# Altium project COMS0005_Coms_Test_Board.PrjPCB
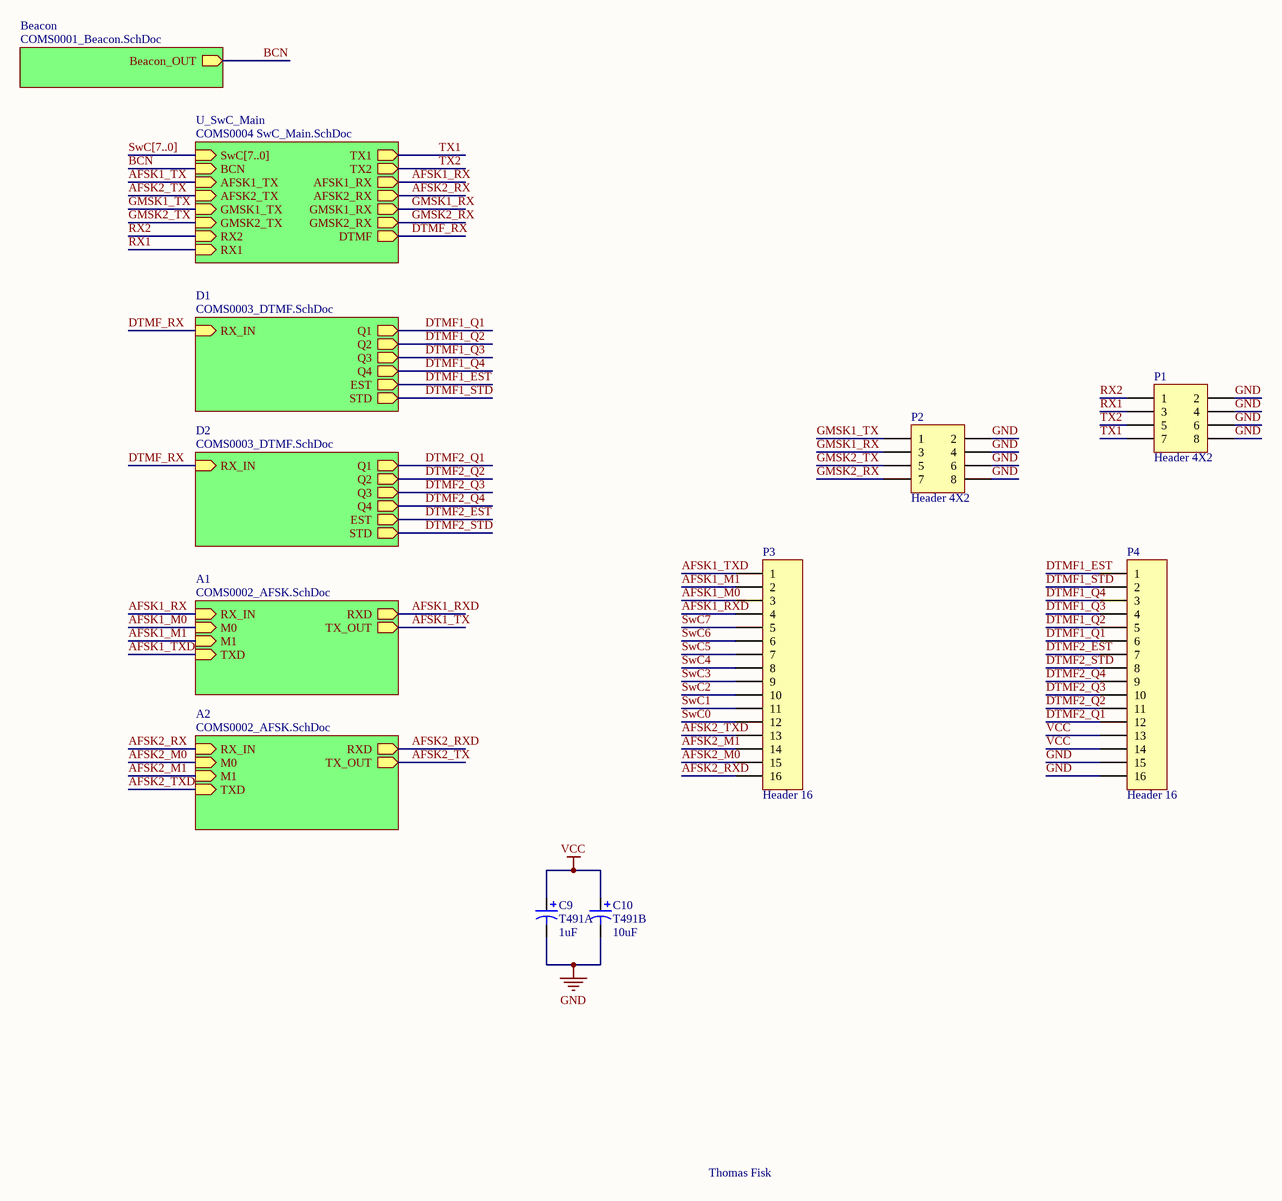
[diagram p0: COMS0010_Comms_Test_Board.SchDoc]
4 sheets, 25 parts. Net scope: hierarchical (ports join the sheet entries above them; power ports are global).
Board file: COMS0009_Coms_Test_Board.PcbDoc
Sheets:
  COMS0010_Comms_Test_Board.SchDoc
    Beacon = COMS0001_Beacon.SchDoc
    U_SwC_Main = COMS0004 SwC_Main.SchDoc
      U_ModemRXMux = COMS0007 ModemRXMux.SchDoc

## Sheet COMS0010_Comms_Test_Board.SchDoc: BLUEsat Communications Test Board
size A3; DrawnBy: Thomas Fisk; Engineer: T. FISK; Organization: BLUEsat Project; Address1: Room 419; Address2: School of EE&T; Address3: UNSW, NSW 2052; Address4: Australia; DocumentNumber: COMS0005; SheetNumber: 1; SheetTotal: 1; Description: Test board for communications subsystem.; Version: 1.0

### Parts
C9  T491A  value 1uF  [A]
C10  T491B  value 10uF  [B]
P1  Header 4X2  [HDR2X4]
P2  Header 4X2  [HDR2X4]
P3  Header 16  [HDR1X16]
P4  Header 16  [HDR1X16]

### Sub-sheets
A1 = COMS0002_AFSK.SchDoc (file not in this document): RX_IN (in), M0 (in), M1 (in), TXD (in), RXD (out), TX_OUT (out)
A2 = COMS0002_AFSK.SchDoc (file not in this document): RX_IN (in), M0 (in), M1 (in), TXD (in), RXD (out), TX_OUT (out)
Beacon = COMS0001_Beacon.SchDoc: Beacon_OUT (out)
D1 = COMS0003_DTMF.SchDoc (file not in this document): RX_IN (in), STD (out), EST (out), Q1 (out), Q2 (out), Q3 (out), Q4 (out)
D2 = COMS0003_DTMF.SchDoc (file not in this document): RX_IN (in), STD (out), EST (out), Q1 (out), Q2 (out), Q3 (out), Q4 (out)
U_SwC_Main = COMS0004 SwC_Main.SchDoc: SwC[7..0] (in), BCN (in), AFSK1_TX (in), AFSK2_TX (in), GMSK1_TX (in), GMSK2_TX (in), TX1 (out), TX2 (out), RX2 (in), RX1 (in), AFSK1_RX (out), AFSK2_RX (out), GMSK1_RX (out), GMSK2_RX (out), DTMF (out)

### Nets
GND: C9.2 C10.2 P1.2 P1.4 P1.6 P1.8 P2.2 P2.4 P2.6 P2.8 P4.15 P4.16
VCC: C9.1 C10.1 P4.13 P4.14
AFSK1_M0: P3.3 ; sheet A1/M0
AFSK1_M1: P3.2 ; sheet A1/M1
AFSK1_RX: sheet A1/RX_IN, sheet U_SwC_Main/AFSK1_RX
AFSK1_RXD: P3.4 ; sheet A1/RXD
AFSK1_TX: sheet A1/TX_OUT, sheet U_SwC_Main/AFSK1_TX
AFSK1_TXD: P3.1 ; sheet A1/TXD
AFSK2_M0: P3.15 ; sheet A2/M0
AFSK2_M1: P3.14 ; sheet A2/M1
AFSK2_RX: sheet A2/RX_IN, sheet U_SwC_Main/AFSK2_RX
AFSK2_RXD: P3.16 ; sheet A2/RXD
AFSK2_TX: sheet A2/TX_OUT, sheet U_SwC_Main/AFSK2_TX
AFSK2_TXD: P3.13 ; sheet A2/TXD
BCN: sheet Beacon/Beacon_OUT, sheet U_SwC_Main/BCN  [project net AF]
DTMF1_EST: P4.1 ; sheet D1/EST
DTMF1_Q1: P4.6 ; sheet D1/Q1
DTMF1_Q2: P4.5 ; sheet D1/Q2
DTMF1_Q3: P4.4 ; sheet D1/Q3
DTMF1_Q4: P4.3 ; sheet D1/Q4
DTMF1_STD: P4.2 ; sheet D1/STD
DTMF2_EST: P4.7 ; sheet D2/EST
DTMF2_Q1: P4.12 ; sheet D2/Q1
DTMF2_Q2: P4.11 ; sheet D2/Q2
DTMF2_Q3: P4.10 ; sheet D2/Q3
DTMF2_Q4: P4.9 ; sheet D2/Q4
DTMF2_STD: P4.8 ; sheet D2/STD
DTMF_RX: sheet D1/RX_IN, sheet D2/RX_IN, sheet U_SwC_Main/DTMF
GMSK1_RX: P2.3 ; sheet U_SwC_Main/GMSK1_RX
GMSK1_TX: P2.1 ; sheet U_SwC_Main/GMSK1_TX
GMSK2_RX: P2.7 ; sheet U_SwC_Main/GMSK2_RX
GMSK2_TX: P2.5 ; sheet U_SwC_Main/GMSK2_TX
RX1: P1.3 ; sheet U_SwC_Main/RX1
RX2: P1.1 ; sheet U_SwC_Main/RX2
SwC0: P3.12
SwC1: P3.11
SwC2: P3.10
SwC3: P3.9
SwC4: P3.8
SwC5: P3.7
SwC6: P3.6
SwC7: P3.5
TX1: P1.7 ; sheet U_SwC_Main/TX1
TX2: P1.5 ; sheet U_SwC_Main/TX2

### Buses and harness runs
bus SwC[7..0] = sheet U_SwC_Main/SwC[7..0]

### Notes on the sheet
- Thomas Fisk
- Title
- Description:
- Size:
- Author:
- Date:
- A3
- Time:
- Version
- Sheet:
- Drawing No.:
- of
- File:

### Library data of the parts
C9 = T491A: Solid Tantalum Chip Capacitor, Standard T491 Series - Industrial Grade; Published: 17-Jul-2002; LatestRevisionDate: 19-Mar-2004; LatestRevisionNote: Silkscreen dimensions re-sized.; DatasheetDocument: Mar-2001; PackageDocument: Mar-2001; PackageReference: A; Publisher: Altium Limited; Code_JEITA: 3216-18; ComponentLink1Description: Manufacturer Link; ComponentLink1URL: http://www.kemet.com/; ComponentLink2Description: Datasheet; ComponentLink2URL: http://www.kemet.com/kemet/web/homepage/kechome.nsf/vapubfilesname/F3102TA.pdf/$file/F3102TA.pdf
C10 = T491B: Solid Tantalum Chip Capacitor, Standard T491 Series - Industrial Grade; Published: 17-Jul-2002; LatestRevisionDate: 19-Mar-2004; LatestRevisionNote: Silkscreen dimensions re-sized.; DatasheetDocument: Mar-2001; PackageDocument: Mar-2001; PackageReference: B; Publisher: Altium Limited; Code_JEITA: 3528-21; ComponentLink1Description: Manufacturer Link; ComponentLink1URL: http://www.kemet.com/; ComponentLink2Description: Datasheet; ComponentLink2URL: http://www.kemet.com/kemet/web/homepage/kechome.nsf/vapubfilesname/F3102TA.pdf/$file/F3102TA.pdf
P1 P2 = Header 4X2: Header, 4-Pin, Dual row; LatestRevisionDate: 17-Jul-2002; LatestRevisionNote: Re-released for DXP Platform.; Publisher: Altium Limited
P3 P4 = Header 16: Header, 16-Pin; LatestRevisionDate: 17-Jul-2002; LatestRevisionNote: Re-released for DXP Platform.; Publisher: Altium Limited

## Sheet COMS0001_Beacon.SchDoc: BLUEsat Beacon
size A3; Author: Daniel Jedrychowski; Engineer: D. JEDRYCHOWSKI; Organization: BLUEsat Project; Address1: Room 419; Address2: School of EE&T; Address3: UNSW, NSW 2052; Address4: Australia; DocumentNumber: COMS0001; SheetNumber: 1; SheetTotal: 1; Description: Morse code continuous wave beacon based on EPROM; Version: 1.1
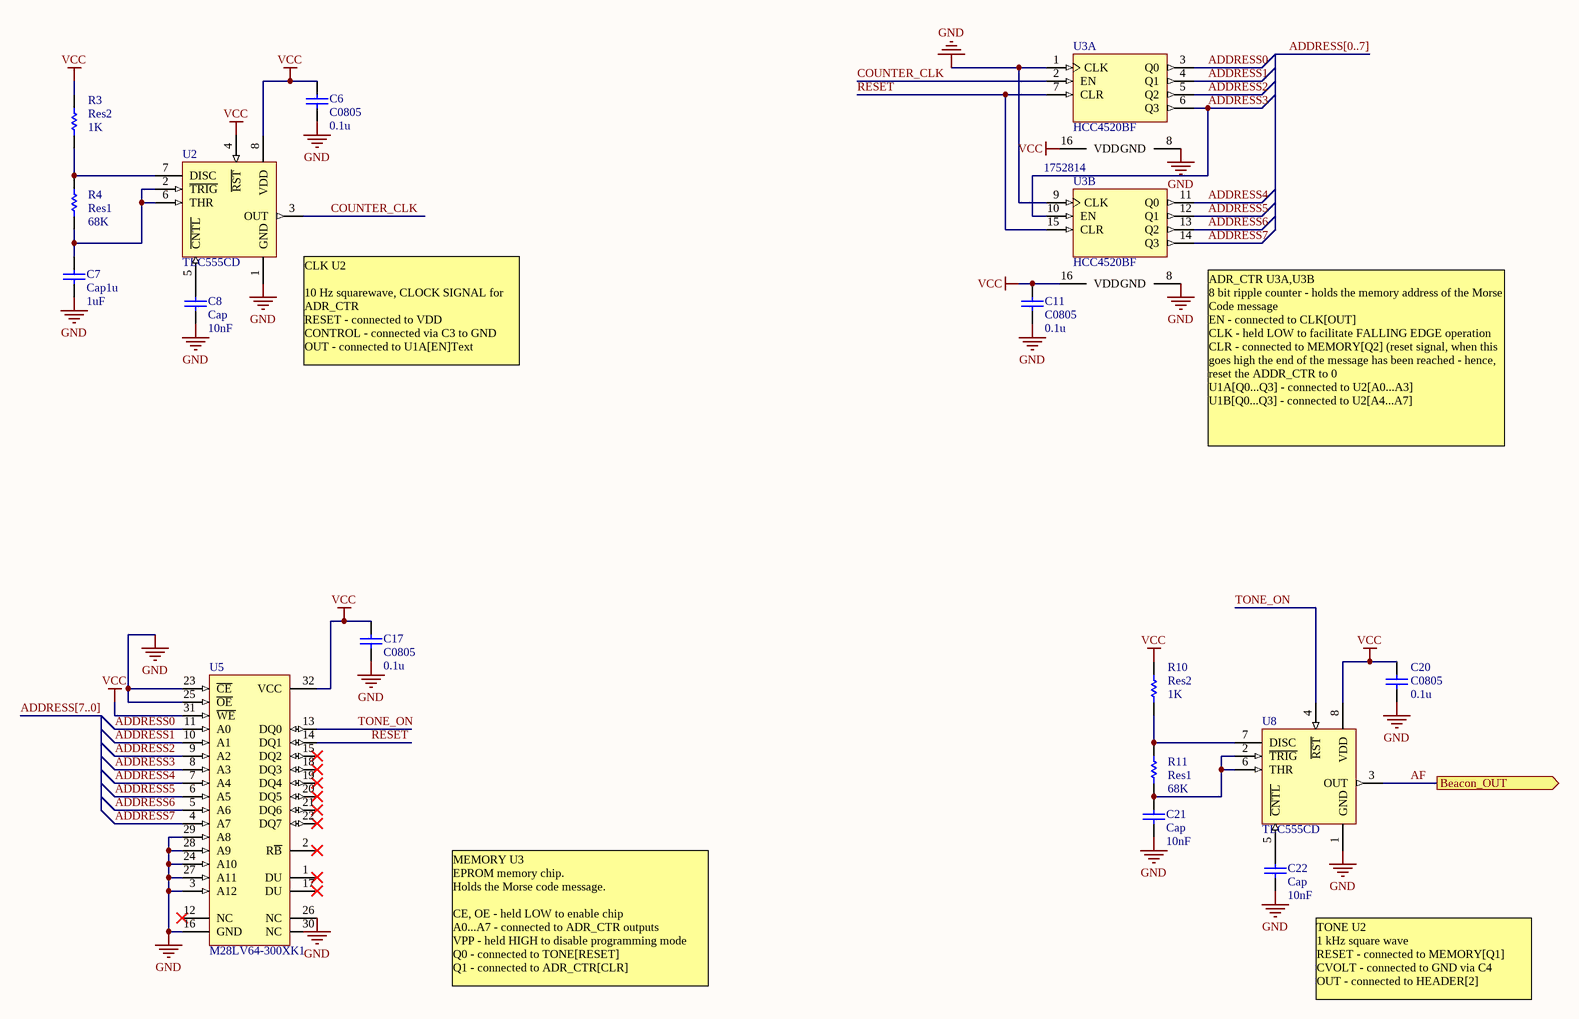
[diagram p1: COMS0001_Beacon.SchDoc]

### Parts
C6  C0805  value 0.1u  [CAPC2012M]
C7  Cap1u  value 1uF  [CAPC2012M]
C8  Cap  value 10nF  [CAPC2012M]
C11  C0805  value 0.1u  [CAPC2012M]
C17  C0805  value 0.1u  [CAPC2012M]
C20  C0805  value 0.1u  [CAPC2012M]
C21  Cap  value 10nF  [CAPC2012M]
C22  Cap  value 10nF  [CAPC2012M]
R3  Res2  value 1K  [RESC2012M]
R4  Res1  value 68K  [RESC2012M]
R10  Res2  value 1K  [RESC2012M]
R11  Res1  value 68K  [RESC2012M]
U2  TLC555CD  [D008_M]
U3  HCC4520BF  [SOIC16_M]  (parts A,B of 2)
U5  M28LV64-300XK1  [PLCC32]
U8  TLC555CD  [D008_M]

### Ports
Beacon_OUT (out)

### Nets
GND: C6.1 C7.1 C8.1 C11.1 C17.1 C20.1 C21.1 C22.1 U2.1(GND) U3.1(CLK) U3.8(GND) U3.9(CLK) U5.3(A12) U5.16(GND) U5.23(~{CE}) U5.24(A10) U5.25(~{OE}) U5.26(NC) U5.27(A11) U5.28(A9) U5.29(A8) U8.1(GND)
VCC: C6.2 C11.2 C17.2 C20.2 R3.2 R10.2 U2.4(~{RST}) U2.8(VDD) U3.16(VDD) U5.31(~{WE}) U5.32(VCC) U8.8(VDD)
ADDRESS0: U3.3(Q0) U5.11(A0)
ADDRESS1: U3.4(Q1) U5.10(A1)
ADDRESS2: U3.5(Q2) U5.9(A2)
ADDRESS3: U3.6(Q3) U3.10(EN) U5.8(A3)
ADDRESS4: U3.11(Q0) U5.7(A4)
ADDRESS5: U3.12(Q1) U5.6(A5)
ADDRESS6: U3.13(Q2) U5.5(A6)
ADDRESS7: U3.14(Q3) U5.4(A7)
AF: U8.3(OUT) ; port Beacon_OUT
COUNTER_CLK: U2.3(OUT) U3.2(EN)
RESET: U3.7(CLR) U3.15(CLR) U5.14(DQ1)
TONE_ON: U5.13(DQ0) U8.4(~{RST})
NetC7_2: C7.2 R4.1 U2.2(~{TRIG}) U2.6(THR)
NetC8_2: C8.2 U2.5(~{CNTL})
NetC21_2: C21.2 R11.1 U8.2(~{TRIG}) U8.6(THR)
NetC22_2: C22.2 U8.5(~{CNTL})
NetR3_1: R3.1 R4.2 U2.7(DISC)
NetR10_1: R10.1 R11.2 U8.7(DISC)

Not connected (* = marked no-connect by the designer): U5 1(DU)* 2(R~{B})* 12(NC)* 15(DQ2)* 17(DU)* 18(DQ3)* 19(DQ4)* 20(DQ5)* 21(DQ6)* 22(DQ7)* 30(NC)

### Buses and harness runs
bus ADDRESS[0..7]
bus ADDRESS[7..0]

### Notes on the sheet
- (near U2) CLK U2
  10 Hz squarewave, CLOCK SIGNAL for ADR_CTR
  RESET - connected to VDD
  CONTROL - connected via C3 to GND
  OUT - connected to U1A[EN]Text
- (near U3) ADR_CTR U3A,U3B
  8 bit ripple counter - holds the memory address of the Morse Code message
  EN - connected to CLK[OUT]
  CLK - held LOW to facilitate FALLING EDGE operation
  CLR - connected to MEMORY[Q2] (reset signal, when this goes high the end of the message has been reached - hence, reset the ADDR_CTR to 0
  U1A[Q0...Q3] - connected to U2[A0...A3]
  U1B[Q0...Q3] - connected to U2[A4...A7]
- MEMORY U3
  EPROM memory chip.
  Holds the Morse code message.
  CE, OE - held LOW to enable chip
  A0...A7 - connected to ADR_CTR outputs
  VPP - held HIGH to disable programming mode
  Q0 - connected to TONE[RESET]
  Q1 - connected to ADR_CTR[CLR]
- TONE U2
  1 kHz square wave
  RESET - connected to MEMORY[Q1]
  CVOLT - connected to GND via C4
  OUT - connected to HEADER[2]
- Title
- Description:
- Size:
- Author:
- Date:
- A3
- Time:
- Version
- Sheet:
- Drawing No.:
- of
- File:

### Library data of the parts
C6-C8 C11 C17 C20-C22 = Cap: Capacitor; Published: 8-Jun-2000; LatestRevisionDate: 17-Jul-2002; LatestRevisionNote: Re-released for DXP Platform.; PackageReference: RAD-0.3; Publisher: Altium Limited; Supplier 1: Farnell
  C6 C11 C17 C20: Supplier Part Number 1: 1650866
  C7: Supplier Part Number 1: 1637035
  C8 C21 C22: Supplier Part Number 1: 9406352
R3 R4 R10 R11 = Res1: Resistor; Published: 8-Jun-2000; LatestRevisionDate: 17-Jul-2002; LatestRevisionNote: Re-released for DXP Platform.; PackageReference: AXIAL-0.3; Publisher: Altium Limited; Supplier 1: Farnell
  R3 R10: Supplier Part Number 1: 1500663
  R4 R11: Supplier Part Number 1: 9234233
U2 U8 = TLC555CD: LinCMOS Timer; Published: 15-Apr-2002; LatestRevisionDate: 13-Apr-2006; LatestRevisionNote: IPC-7351 Footprint Added.; DatasheetVersion: Oct-1988; PackageVersion: Jan-1998; PackageReference: D008; Publisher: Altium Limited; PackageDescription: 8-Pin Small Outline Integrated Circuit 1.27 mm Pitch; Code_IPC: SOIC127P600-8; ComponentLink1Description: Manufacturer Link; ComponentLink1URL: http://www.ti.com/; ComponentLink2Description: Datasheet; ComponentLink2URL: http://www-s.ti.com/sc/ds/tlc555.pdf; Supplier 1: Farnell; Supplier Part Number 1: 1575195
  U2: Supplier 2: Farnell
  U8: Supplier 2: Mouser
U3 = HCC4520BF: Dual Binary Up-Counter; Published: 8-Jun-2000; LatestRevisionDate: 06-Jun-2005; LatestRevisionNote: Stylized 3D Model Added.; DatasheetVersion: Jun-1989; PackageVersion: Apr-1996; PackageReference: DIP16; Publisher: Altium Limited; PackageDescription: DIP; 16 Leads; Row Spacing 7.62 mm; Pitch 2.54 mm; ComponentLink1Description: Manufacturer Link; ComponentLink1URL: http://www.st.com/; Supplier 1: Farnell; Supplier Part Number 1: 1752814; Supplier 2: Farnell
U5 = M28LV64-300XK1: 64K (8K x 8) Low-Voltage Parallel EEPROM with Software Data Protection; Note: Do Not Use pins 1 and 17 (DU).; Published: 24-Aug-2001; LatestRevisionDate: 06-Jun-2005; LatestRevisionNote: Stylized 3D Model Added.; DatasheetVersion: May-1997; PackageVersion: Jun-1998; PackageReference: PLCC32; Publisher: Altium Limited; PackageDescription: Leaded Chip Carrier; 32 Leads; Body 11.5 x 14 mm; ComponentLink1Description: Manufacturer Link; ComponentLink1URL: http://www.st.com/; Code_JEDEC: MS-016-AE; Code_IPC: PLCC/R-32

## Sheet COMS0004 SwC_Main.SchDoc: BLUEsat Switching Circuit Overview
size A3; Engineer: D. JEDRYCHOWSKI; Organization: BLUEsat Project; Address1: Room 419; Address2: School of EE&T; Address3: UNSW, NSW 2052; Address4: Australia; DocumentNumber: COMS0004; SheetNumber: 1; SheetTotal: 4; Description: Overview of Switching Circuit; Version: 1.0
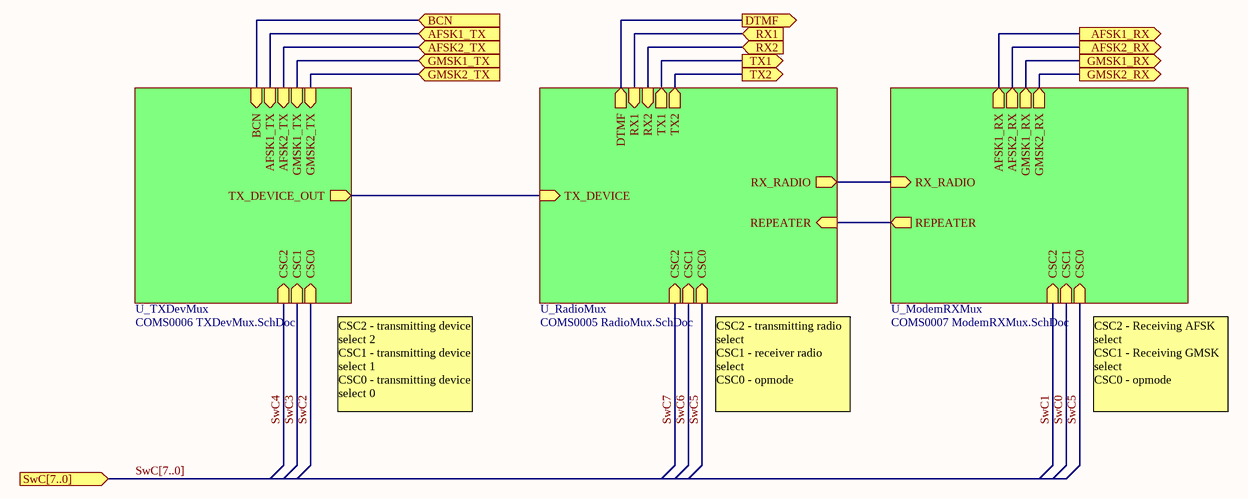
[diagram p2: COMS0004 SwC_Main.SchDoc]

### Sub-sheets
U_ModemRXMux = COMS0007 ModemRXMux.SchDoc: RX_RADIO (in), REPEATER (out), AFSK1_RX (out), AFSK2_RX (out), GMSK1_RX (out), GMSK2_RX (out), CSC2 (in), CSC1 (in), CSC0 (in)
U_RadioMux = COMS0005 RadioMux.SchDoc (file not in this document): RX_RADIO (out), RX1 (in), RX2 (in), TX1 (out), TX2 (out), TX_DEVICE (in), REPEATER (in), CSC2 (in), CSC1 (in), CSC0 (in), DTMF (out)
U_TXDevMux = COMS0006 TXDevMux.SchDoc (file not in this document): CSC2 (in), BCN (in), AFSK1_TX (in), AFSK2_TX (in), GMSK1_TX (in), GMSK2_TX (in), TX_DEVICE_OUT (out), CSC1 (in), CSC0 (in)

### Ports
AFSK1_RX (out), AFSK1_TX (in), AFSK2_RX (out), AFSK2_TX (in), BCN (in), DTMF (out), GMSK1_RX (out), GMSK1_TX (in), GMSK2_RX (out), GMSK2_TX (in), RX1 (in), RX2 (in), SwC[7..0] (in), TX1 (out), TX2 (out)

### Nets
AF: port BCN, sheet U_TXDevMux/BCN
AFSK1_RX: port AFSK1_RX, sheet U_ModemRXMux/AFSK1_RX
AFSK1_TX: port AFSK1_TX, sheet U_TXDevMux/AFSK1_TX
AFSK2_RX: port AFSK2_RX, sheet U_ModemRXMux/AFSK2_RX
AFSK2_TX: port AFSK2_TX, sheet U_TXDevMux/AFSK2_TX
DTMF_RX: port DTMF, sheet U_RadioMux/DTMF
GMSK1_RX: port GMSK1_RX, sheet U_ModemRXMux/GMSK1_RX
GMSK1_TX: port GMSK1_TX, sheet U_TXDevMux/GMSK1_TX
GMSK2_RX: port GMSK2_RX, sheet U_ModemRXMux/GMSK2_RX
GMSK2_TX: port GMSK2_TX, sheet U_TXDevMux/GMSK2_TX
RX1: port RX1, sheet U_RadioMux/RX1
RX2: port RX2, sheet U_RadioMux/RX2
SwC5: sheet U_ModemRXMux/CSC0, sheet U_RadioMux/CSC0
TX1: port TX1, sheet U_RadioMux/TX1
TX2: port TX2, sheet U_RadioMux/TX2
NetU6_3: sheet U_ModemRXMux/REPEATER, sheet U_RadioMux/REPEATER
NetU6_4: sheet U_ModemRXMux/RX_RADIO, sheet U_RadioMux/RX_RADIO
(unnamed): sheet U_TXDevMux/TX_DEVICE_OUT, sheet U_RadioMux/TX_DEVICE

### Buses and harness runs
bus SwC[7..0] = port SwC[7..0]

### Notes on the sheet
- CSC2 - transmitting device select 2
  CSC1 - transmitting device select 1
  CSC0 - transmitting device select 0
- CSC2 - transmitting radio select
  CSC1 - receiver radio select
  CSC0 - opmode
- CSC2 - Receiving AFSK select
  CSC1 - Receiving GMSK select
  CSC0 - opmode
- Title
- Description:
- Size:
- Author:
- Date:
- A3
- Time:
- Version
- Sheet:
- Drawing No.:
- of
- File:

## Sheet COMS0007 ModemRXMux.SchDoc: BLUEsat Switching Circuit
size A3; Engineer: D. JEDRYCHOWSKI; Organization: BLUEsat Project; Address1: Room 419; Address2: School of EE&T; Address3: UNSW, NSW 2052; Address4: Australia; DocumentNumber: COMS0007; SheetNumber: 4; SheetTotal: 4; Description: Selects the GMSK and AFSK modems to be used for reception; Version: 1.0
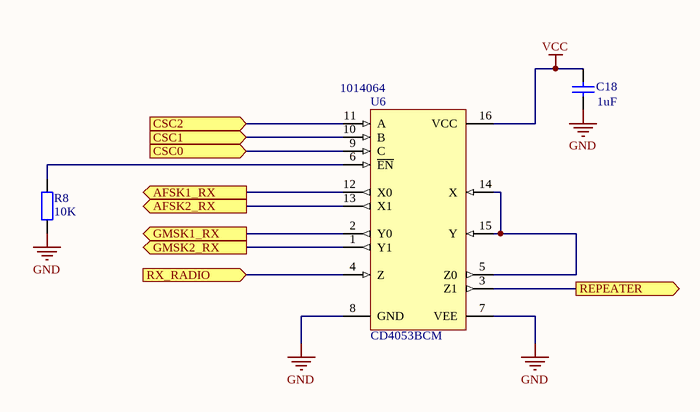
[diagram p3: COMS0007 ModemRXMux.SchDoc]

### Parts
C18  value 1uF  [0805]  (hidden comment: C1210)
R8  value 10K  [RESC2012N]  (hidden comment: Res1)
U6  CD4053BCM  Supplier Part Number 1: 1014064  [M16A_M]

### Ports
AFSK1_RX (out), AFSK2_RX (out), CSC0 (in), CSC1 (in), CSC2 (in), GMSK1_RX (out), GMSK2_RX (out), REPEATER (out), RX_RADIO (in)

### Nets
GND: C18.1 R8.1 U6.7(VEE) U6.8(GND)
VCC: C18.2 U6.16(VCC)
AFSK1_RX: U6.12(X0) ; port AFSK1_RX
AFSK2_RX: U6.13(X1) ; port AFSK2_RX
GMSK1_RX: U6.2(Y0) ; port GMSK1_RX
GMSK2_RX: U6.1(Y1) ; port GMSK2_RX
SwC0: U6.10(B) ; port CSC1
SwC1: U6.11(A) ; port CSC2
SwC5: U6.9(C) ; port CSC0
NetR8_2: R8.2 U6.6(~{EN})
NetU6_3: U6.3(Z1) ; port REPEATER
NetU6_4: U6.4(Z) ; port RX_RADIO
NetU6_5: U6.5(Z0) U6.14(X) U6.15(Y)

### Notes on the sheet
- Title
- Description:
- Size:
- Author:
- Date:
- A3
- Time:
- Version
- Sheet:
- Drawing No.:
- of
- File:
- (in symbol CD4053BCM, part A) S0
- (in symbol CD4053BCM, part B) S0
- (in symbol CD4053BCM, part C) S0

### Library data of the parts
C18 = Cap: Capacitor; Published: 8-Jun-2000; LatestRevisionDate: 17-Jul-2002; LatestRevisionNote: Re-released for DXP Platform.; PackageReference: RAD-0.3; Publisher: Altium Limited; PackageDescription: Radial Cap, Thru-Hole; 2 Leads; 0.3 in Pin Spacing; Supplier 1: Farnell; Supplier Part Number 1: 1637035
R8 = Res2: Resistor; Published: 8-Jun-2000; LatestRevisionDate: 17-Jul-2002; LatestRevisionNote: Re-released for DXP Platform.; PackageReference: AXIAL-0.4; Publisher: Altium Limited; PackageDescription: Axial Device, Thru-Hole; 2 Leads; 0.4 in Pin Spacing; Supplier 1: Farnell; Supplier Part Number 1: 1811779
U6 = CD4053BCM: Triple 2-Channnel Analog Multiplexer/Demutiplexer; Published: 17-Jul-2002; LatestRevisionDate: 13-Apr-2006; LatestRevisionNote: IPC-7351 Footprint Added.; DatasheetVersion: Jan-1999; PackageVersion: 2000; PackageReference: M16A; Publisher: Altium Limited; PackageDescription: 16-Pin Small Outline Integrated Circuit 1.27 mm Pitch; ComponentLink1Description: Manufacturer Link; ComponentLink1URL: http://www.fairchildsemi.com/; ComponentLink2Description: Datasheet; ComponentLink2URL: http://www.fairchildsemi.com/ds/CD%2FCD4052BC.pdf; Code_IPC: SOIC127P600-16; Supplier 1: Farnell

## Nets that join several sheets
GND: COMS0010_Comms_Test_Board (12 pins), COMS0001_Beacon (22 pins), COMS0007 ModemRXMux (C18.1 R8.1 U6.7 U6.8)
VCC: COMS0010_Comms_Test_Board (C9.1 C10.1 P4.13 P4.14), COMS0001_Beacon (12 pins), COMS0007 ModemRXMux (C18.2 U6.16)
GMSK1_RX: COMS0010_Comms_Test_Board (P2.3), COMS0007 ModemRXMux (U6.2)
GMSK2_RX: COMS0010_Comms_Test_Board (P2.7), COMS0007 ModemRXMux (U6.1)
SwC0: COMS0010_Comms_Test_Board (P3.12), COMS0007 ModemRXMux (U6.10)
SwC1: COMS0010_Comms_Test_Board (P3.11), COMS0007 ModemRXMux (U6.11)
SwC5: COMS0010_Comms_Test_Board (P3.7), COMS0007 ModemRXMux (U6.9)